# Altium project LED_MAINBOARD.PrjPcb
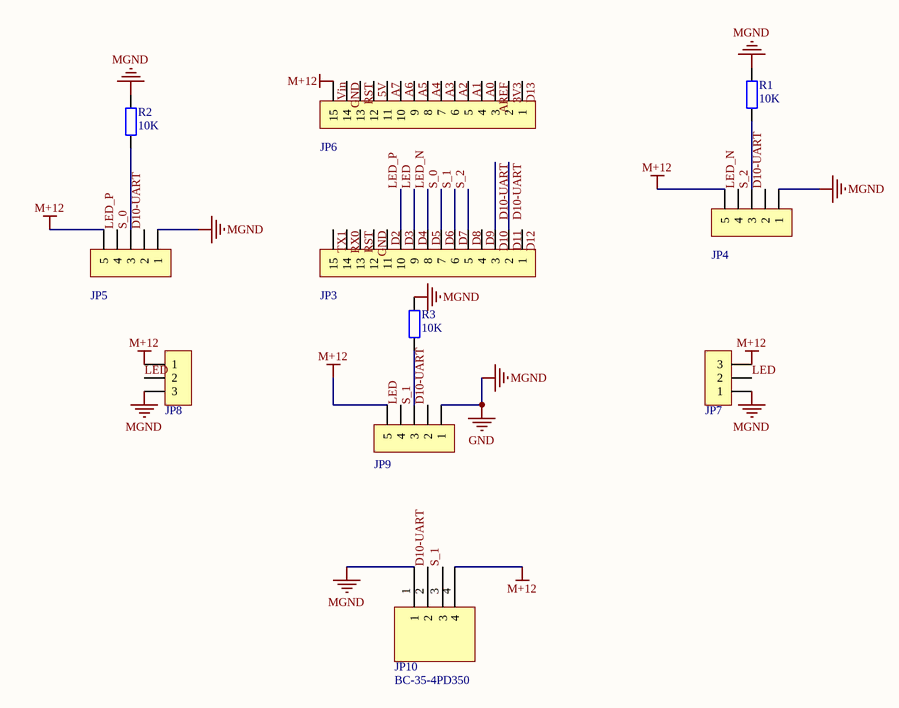
[diagram p0: LED_MAINBOARD.SchDoc]
1 sheet, 11 parts. Net scope: global (net labels, ports and power ports of the same name join across sheets).
Board file: LED_MAINBOARD.PcbDoc

## Sheet LED_MAINBOARD.SchDoc
size A4

### Parts
JP3  HDR-1X15  [HDR2.54-M-LI-15P]  (value not drawn)
JP4  HDR-1X5  [ZH1.5-WS-5P]  (value not drawn)
JP5  HDR-1X5  [ZH1.5-WS-5P]  (value not drawn)
JP6  HDR-1X15  [HDR2.54-M-LI-15P]  (value not drawn)
JP7  HDR-1X3  [ZH1.5-WS-3P]  (value not drawn)
JP8  HDR-1X3  [ZH1.5-WS-3P]  (value not drawn)
JP9  HDR-1X5  [ZH1.5-WS-5P]  (value not drawn)
JP10  BC-35-4PD350  [BC-35-4PD350]
R1  10K  [R 0603_L]
R2  10K  [R 0603_L]
R3  10K  [R 0603_L]

### Nets
GND: JP3.12 JP4.1 JP5.1 JP6.14 JP7.1 JP8.3 JP9.1 JP10.1 R1.2 R2.2 R3.2  [also labelled MGND]
Vin: JP4.5 JP5.5 JP6.15 JP7.3 JP8.1 JP9.5 JP10.4  [also labelled M+12]
3V3: JP6.2
5V: JP6.12
A0: JP6.4
A1: JP6.5
A2: JP6.6
A3: JP6.7
A4: JP6.8
A5: JP6.9
A6: JP6.10
A7: JP6.11
AREF: JP6.3
D2: JP3.11
D3: JP3.10 JP5.4  [also labelled LED_P]
D4: JP3.9 JP7.2 JP8.2 JP9.4  [also labelled LED]
D5: JP3.8 JP4.4  [also labelled LED_N]
D6: JP3.7 JP5.3 R2.1  [also labelled S_0]
D7: JP3.6 JP9.3 JP10.3 R3.1  [also labelled S_1]
D8: JP3.5 JP4.3 R1.1  [also labelled S_2]
D9: JP3.4
D10: JP3.2 JP3.3 JP4.2 JP5.2 JP9.2 JP10.2  [also labelled D10-UART, D11]
D12: JP3.1
D13: JP6.1
RST: JP3.13 JP6.13
RX0: JP3.14
TX1: JP3.15

### Library data of the parts
JP3 JP6 = Header 15: 15P接插件; 版权归属: 源创客; BOM名称: 15P接插件; 学习资源: www.ooocke.com
JP4 JP5 JP9 = Header 5: 5P接插件; 版权归属: 源创客; BOM名称: 5P接插件; 学习资源: www.ooocke.com
JP7 JP8 = Header 3: 3P接插件; 版权归属: 源创客; BOM名称: 3P接插件; 学习资源: www.ooocke.com
R1-R3 = R: 贴片电阻; 版权归属: 源创客; BOM名称: 贴片电阻; 学习资源: www.ooocke.com